# EAGLE design servo44 (EAGLE 8.0.2)
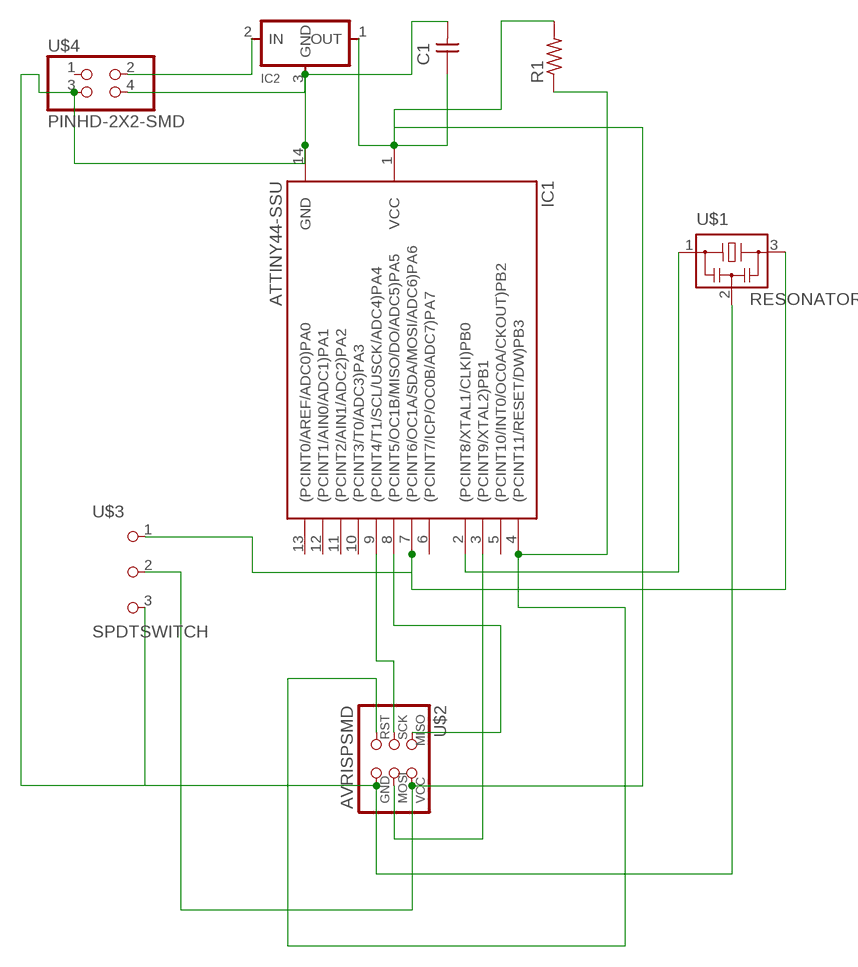
[diagram p0: schematic, sheet 1]

## Parts
C1  CAP-UNPOLARIZEDFAB  [C1206FAB]
IC1  ATTINY44-SSU  [SOIC14]
IC2  REGULATORSOT23  [SOT23]
R1  RES-US1206FAB  [R1206FAB]
U$1  RESONATOR  [EFOBM]
U$2  AVRISPSMD  [2X03SMD]
U$3  SPDTSWITCH  [SPDTSWITCH]
U$4  PINHD-2X2-SMD  [2X02SMD]

## Nets
N$1: IC1.8((PCINT5/OC1B/MISO/DO/ADC5)PA5) U$2.1(MISO)
N$2: IC1.9((PCINT4/T1/SCL/USCK/ADC4)PA4) U$2.3(SCK)
N$3: IC1.4((PCINT11/RESET/DW)PB3) R1.1 U$2.5(RST)
N$4: IC2.2(IN) U$4.2
N$5: IC1.7((PCINT6/OC1A/SDA/MOSI/ADC6)PA6) U$2.4(MOSI) U$3.1
N$6: C1.2 IC1.14(GND) IC2.3(GND) U$1.2 U$2.6(GND) U$3.3 U$4.3 U$4.4
N$7: IC1.2((PCINT8/XTAL1/CLKI)PB0) U$1.1
N$8: IC1.3((PCINT9/XTAL2)PB1) U$1.3
N$10: C1.1 IC1.1(VCC) IC2.1(OUT) R1.2 U$2.2(VCC) U$3.2
Unconnected: IC1.5((PCINT10/INT0/OC0A/CKOUT)PB2) IC1.6((PCINT7/ICP/OC0B/ADC7)PA7) IC1.10((PCINT3/T0/ADC3)PA3) IC1.11((PCINT2/AIN1/ADC2)PA2) IC1.12((PCINT1/AIN0/ADC1)PA1) IC1.13((PCINT0/AREF/ADC0)PA0) U$4.1

## Library data of the parts
C1 = 01_fab:CAP-UNPOLARIZED
IC1 = 01_fab:ATTINY44
IC2 = 01_fab:REGULATOR
R1 = 01_fab:RES-US: Resistor (US Symbol) Variants with postfix FAB are widened to allow the routing of internal traces
U$1 = 01_fab:RESONATOR
U$2 = 01_fab:AVRISP
U$3 = 01_fab:SPDTSWITCH
U$4 = 01_fab:PINHD-2X2-SMD

## Board
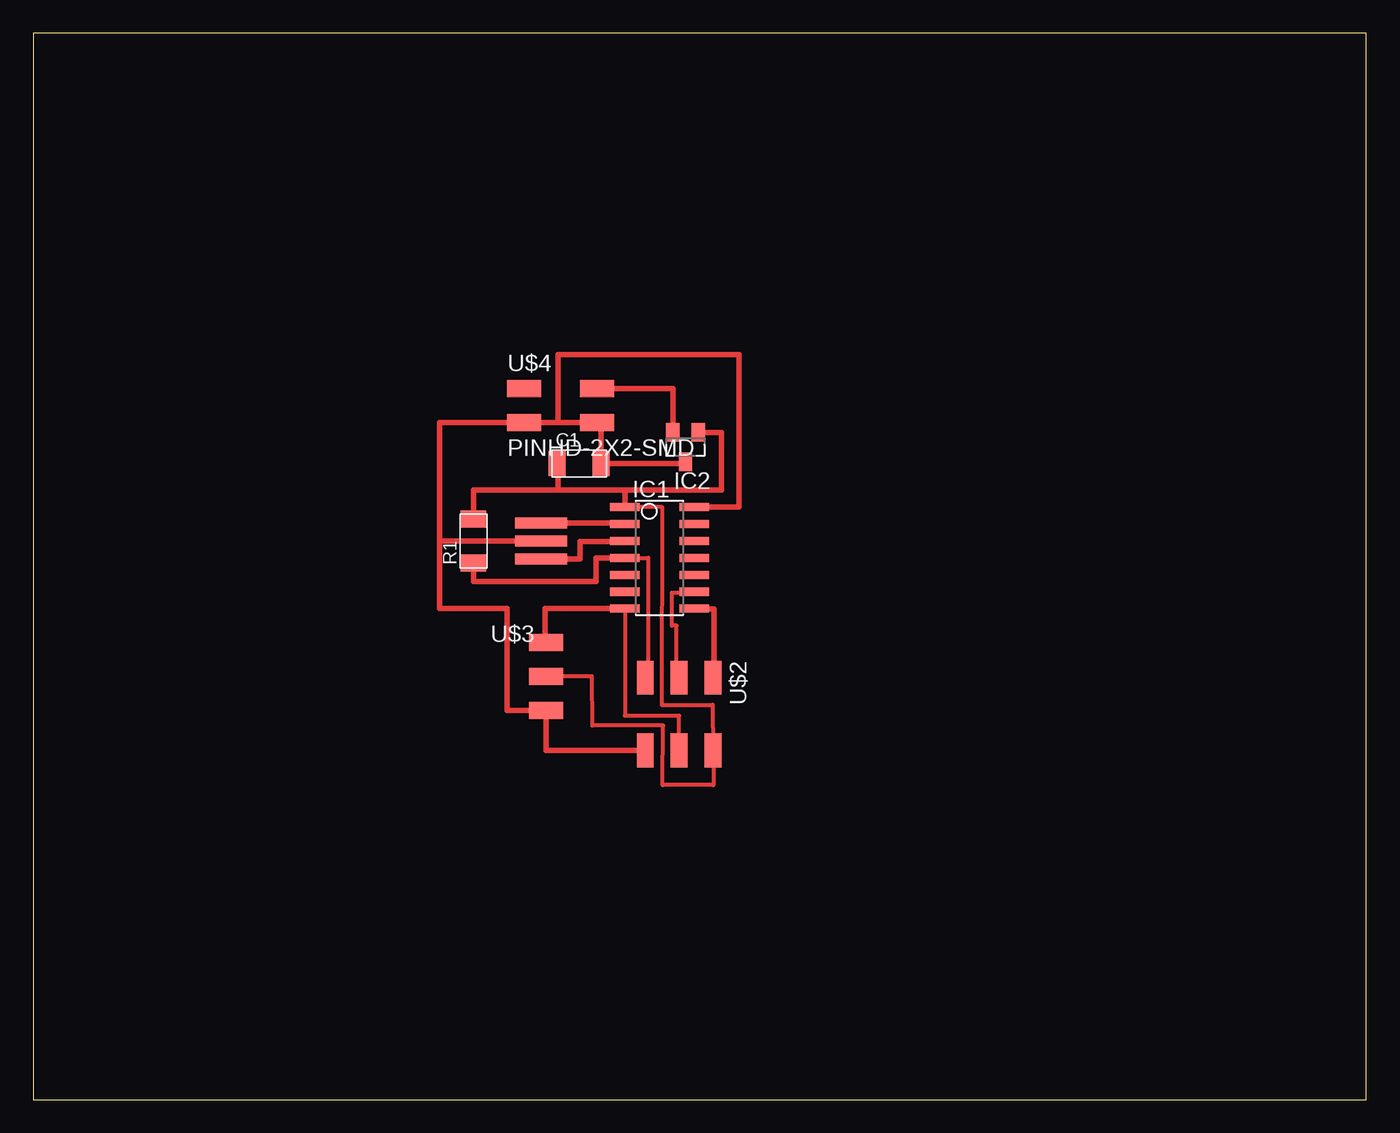
[diagram p1: board, top side]

Size 100 x 80 mm. Coordinates in mm from the lower left corner, seen from the top.
Outline: 0,0 100,0 100,80 0,80 0,0
Copper layers (1*16): Top 0.035mm / dielectric 1.5mm / Bottom 0.035mm
Design rules "default *": minimum track width 10mil, minimum drill 24mil, track to track 16mil, track to pad 16mil, pad to pad 16mil, via to via 16mil, smd to smd 16mil, copper to edge 40mil, drill to drill 8mil, minimum pad ring 10mil, minimum via ring 8mil, stop-mask expansion 4mil, vias tented up to drill 0mil, thermal gap 10mil

### Footprints (pad centres in the part's own frame; a part is rotated, then mirrored left to right if it is on the bottom)
C1206FAB = smd 1.27 x 1.905: 1 -1.651,0; 2 1.651,0
SOIC14 = smd 0.61 x 2.21: 1 -3.81,-2.603; 2 -2.54,-2.603; 3 -1.27,-2.603; 4 0,-2.603; 5 1.27,-2.603; 6 2.54,-2.603; 7 3.81,-2.603; 8 3.81,2.603; 9 2.54,2.603; 10 1.27,2.603; 11 0,2.603; 12 -1.27,2.603; 13 -2.54,2.603; 14 -3.81,2.603
SOT23 = smd 1 x 1.4: 1 -0.95,-1.1; 2 0.95,-1.1; 3 0,1.1
R1206FAB = smd 1.27 x 1.905: 1 -1.651,0; 2 1.651,0
EFOBM = smd 0.8 x 3.9: 1 -1.35,0; 2 0,0; 3 1.35,0
2X03SMD = smd 2.54 x 1.27: 1 -2.54,2.54; 2 2.92,2.54; 3 -2.54,0; 4 2.92,0; 5 -2.54,-2.54; 6 2.92,-2.54
SPDTSWITCH = smd 2.54 x 1.27: 1 0.38,2.54; 2 0.38,0; 3 0.38,-2.54
2X02SMD = smd 2.54 x 1.27: 1 -2.54,1.27; 2 2.92,1.27; 3 -2.54,-1.27; 4 2.92,-1.27

### Placement (x,y rotation side)
C1  40.96,47.72 0 top
IC1  46.99,40.64 270 top
IC2  48.93,48.96 180 top
R1  33.02,41.91 90 top
U$1  38.1,41.91 270 top
U$2  48.45,29.11 270 top
U$3  38.1,31.75 0 top
U$4  39.37,52.07 0 top

### Tracks (layer width: path | path; a pad name or v marks a point on that pad's centre or on a via)
N$1
  Top 0.406: U$2.1 51.05,31.66 51.05,36.8 49.59,36.8 IC1.8
N$2
  Top 0.305: IC1.9 49.59,38.04 47.91,38.04 47.91,35.56 48.26,35.56 48.26,31.66 U$2.3
N$3
  Top 0.305: IC1.4 46.13,40.64 46.13,32.45 45.91,32.45 U$2.5
  Top 0.406: 44.39,40.58 IC1.4 42.23,40.64 42.23,38.86 33.02,38.86 R1.1
N$4
  Top 0.406: U$4.2 47.98,53.34 IC2.2
N$5
  Top 0.305: U$2.4 48.45,28.8 44.39,28.8 IC1.7
  Top 0.406: U$3.1 38.39,34.29 38.39,36.86 44.39,36.86 IC1.7
N$6
  Top 0.406: U$2.6 38.48,26.2 U$3.3 35.56,29.21 35.56,36.83 30.48,36.83 30.48,41.91 | U$1.2 30.48,41.91 | 50.03,44.45 IC1.14 52.93,44.45 52.93,55.88 39.37,55.88 39.37,50.8 | 42.61,47.53 C1.2 | C1.2 42.61,50.8 U$4.4 39.37,50.8 | C1.2 48.93,47.72 IC2.3 | 39.37,50.8 U$4.3 30.48,50.8 30.48,41.91
N$7
  Top 0.406: U$1.1 44.39,43.26 IC1.2
N$8
  Top 0.406: U$1.3 41.02,40.56 41.02,41.88 44.39,41.88 IC1.3
N$10
  Top 0.305: IC1.1 47.18,44.45 47.15,29.62 50.96,29.62 U$2.2 51.02,26.2 51.02,23.59 47.21,23.59 47.24,28.07 41.94,28.07 41.91,31.75 U$3.2
  Top 0.406: R1.2 33.02,45.72 39.37,45.72 | 44.39,45.72 39.37,45.72 | 44.39,45.72 IC1.1 | 39.37,45.72 39.37,47.72 C1.1 39.31,47.66 | IC2.1 51.63,50.06 51.63,45.72 44.39,45.72